# Altium schematic sheet 1_unextended_ISO_top.SchDoc: =ProjectTitle
size A4; Engineer: 4pplet; Address1: github.com/4pplet/cyber60; Address2: Licence: CERN-OHL-S; SheetNumber: 1; SheetTotal: 5; ProjectName: waffling60
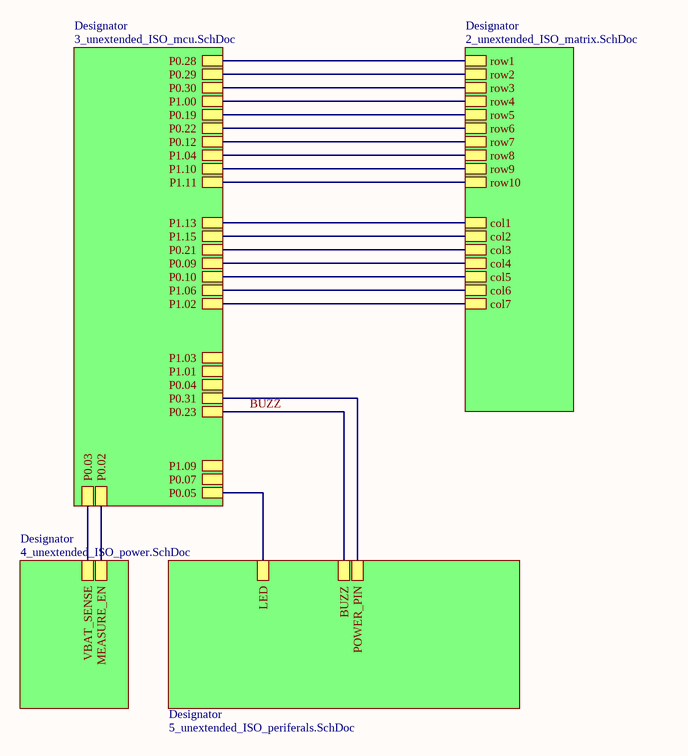
[diagram p0: 1_unextended_ISO_top.SchDoc]

## Sub-sheets
Designator = 3_unextended_ISO_mcu.SchDoc: P1.02, P1.04, P1.06, P0.12, P1.09, P1.11, P1.10, P0.07, P0.21, P0.23, P1.03, P1.00, P1.01, P0.22, P0.19, P0.10, P0.09, P0.31, P0.29, P1.13, P1.15, P0.05, P0.04, P0.02, P0.28, P0.30, P0.03
Designator = 2_unextended_ISO_matrix.SchDoc: col6, col5, col7, col3, col2, col1, col4, row3, row1, row4, row2, row5, row6, row9, row7, row8, row10
Designator = 4_unextended_ISO_power.SchDoc: VBAT_SENSE, MEASURE_EN
Designator = 5_unextended_ISO_periferals.SchDoc: POWER_PIN, BUZZ, LED

## Nets
BUZZ: sheet Designator/P0.23, sheet Designator/BUZZ
(unnamed): sheet Designator/P1.02, sheet Designator/col7
(unnamed): sheet Designator/P1.04, sheet Designator/row8
(unnamed): sheet Designator/P1.06, sheet Designator/col6
(unnamed): sheet Designator/P0.12, sheet Designator/row7
(unnamed): sheet Designator/P1.11, sheet Designator/row10
(unnamed): sheet Designator/P1.10, sheet Designator/row9
(unnamed): sheet Designator/P0.21, sheet Designator/col3
(unnamed): sheet Designator/P1.00, sheet Designator/row4
(unnamed): sheet Designator/P0.22, sheet Designator/row6
(unnamed): sheet Designator/P0.19, sheet Designator/row5
(unnamed): sheet Designator/P0.10, sheet Designator/col5
(unnamed): sheet Designator/P0.09, sheet Designator/col4
(unnamed): sheet Designator/P0.31, sheet Designator/POWER_PIN
(unnamed): sheet Designator/P0.29, sheet Designator/row2
(unnamed): sheet Designator/P1.13, sheet Designator/col1
(unnamed): sheet Designator/P1.15, sheet Designator/col2
(unnamed): sheet Designator/P0.05, sheet Designator/LED
(unnamed): sheet Designator/P0.02, sheet Designator/MEASURE_EN
(unnamed): sheet Designator/P0.28, sheet Designator/row1
(unnamed): sheet Designator/P0.30, sheet Designator/row3
(unnamed): sheet Designator/P0.03, sheet Designator/VBAT_SENSE

## Notes on the sheet
- Title
- Size:
- Date:
- A4
- Number:
- Time:
- Revision:
- Sheet
- of
- File: